# Altium schematic sheet LED Driver.SchDoc
size 297 x 209 mm; CompanyName: Sainsbury Wellcome Centre; Organization: FabLab; Address1: Sainsbury Wellcome Centre; Address2: 25 Howland Street; Address3: London; Address4: W1T 4JG; DocumentNumber: 3; SheetNumber: 3; SheetTotal: 3; swcgroup: FabLab; Org: Sainsbury Wellcome Centre; Add1: 25 Howland Street; Add2: London; Add3: W1T 4JG; WebAddress: www.sainsburywellcome.org; SheetSize: A4; SheetName: LED Driver
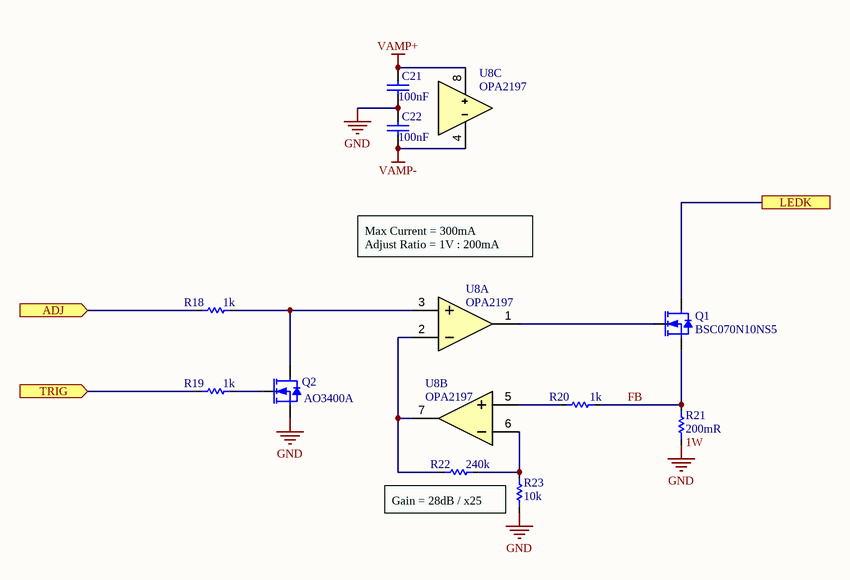
[diagram p0: LED Driver.SchDoc]

## Parts
C21  value 100nF  [CAP_CHIP_0603]  (hidden comment: C0603-100nF-50V)
C22  value 100nF  [CAP_CHIP_0603]  (hidden comment: C0603-100nF-50V)
Q1  BSC070N10NS5  [TDSON-8]
Q2  AO3400A  [SOT23]
R18  value 1k  [RES_CHIP_0603]  (hidden comment: R0603-1K)
R19  value 1k  [RES_CHIP_0603]  (hidden comment: R0603-1K)
R20  value 1k  [RES_CHIP_0603]  (hidden comment: R0603-1K)
R21  value 200mR  Power Rating: 1W  [RES_CHIP_2010]  (hidden comment: R2010-0R2)
R22  value 240k  [RES_CHIP_0603]  (hidden comment: R0603-240K)
R23  value 10k  [RES_CHIP_0603]  (hidden comment: R0603-10K)
U8  OPA2197  [SOIC8]  (parts A,B,C of 3)

## Ports
ADJ (in), LEDK, TRIG (in)

## Nets
GND: C21.1 C22.2 Q2.2(S) R21.1 R23.1
VAMP+: C21.2 U8.8(V+)
VAMP-: C22.1 U8.4(V-)
ADJ: R18.2 ; port ADJ
FB: Q1.1,2,3(S) R20.2 R21.2
LEDK: Q1.5(D) ; port LEDK
TRIG: R19.2 ; port TRIG
NetQ1_4: Q1.4(G) U8.1(AOUT)
NetQ2_1: Q2.1(G) R19.1
NetQ2_3: Q2.3(D) R18.1 U8.3(A+)
NetR20_1: R20.1 U8.5(B+)
NetR22_1: R22.1 R23.2 U8.6(B-)
NetR22_2: R22.2 U8.2(A-) U8.7(BOUT)

## Notes on the sheet
- Max Current = 300mA
  Adjust Ratio = 1V : 200mA
- Gain = 28dB / x25
- FILE
- VARIANT
- DATE
- REVISION
- SHEET
- /
- PROJECT
- SIZE

## Library data of the parts
C21 C22 = CMP-611-0027-24: 0603 Multilayer Ceramic Capacitors MLCC; PartNumber: CC0603KRX7R9BB104; Tolerance: 10%; Pick&PlaceFootprint: C0603; Dielectric: X7R; Voltage Rating: 50V; Capacitor Type: Ceramic; RoHS: Yes; Mount: SMD; LCSC Part N.: C14663; Case/Package: 0603
Q1 = CMP-830-0011-2: MOSFET Power-Transistor, 100V / Superior thermal resistance; Polarity: N-CHANNEL; Fall Time: 6ns; Gate to Source Voltage (Vgs): 20V; Max Power Dissipation: 83W; Rise Time: 5ns; Drain to Source Resistance: 10.2mR; LCSC Part N.: C534364; Drain to Source Voltage (Vdss): 100V; PartNumber: BSC070N10NS5
Q2 = CMP-810-0002-2: 30V 5.7A 26.5mΩ@10V,5.7A 1.4W 1.5V@250uA 1 NChannel SOT-23-3L MOSFETs; Gate-Source Voltage (Vgs): 12V; Pick&PlaceFootprint: SOT-23; RDS(ON): 26.5mR; Switching Time: 34.5ns; LCSC Part N.: C20917; Drain-Source Voltage (Vds): 30V; Mount: Surface Mount; PartNumber: AO3400A; Power Dissipation: 1.4W; Drain Current (Id): 5.7A; Polarity: N Channel
R18-R20 = CMP-633-0013-26: 100mW Thick Film Resistors 75V ±100ppm/℃ ±1% 0603 Chip Resistor; PartNumber: 0603WAF1001T5E; Pick&PlaceFootprint: R0603; Number of Resistors: 1; Voltage Rating: 75V; Mount: Surface Mount; Case/Package: 0603; LCSC Part N.: C21190; Tolerance: 1%; Power Rating: 100mW
R21 = CMP-633-0149-2: Res Metal Strip 2010 0.2 Ohm 1% 1W ±75ppm/°C Molded SMD SMD Embossed Plastic T/R; PartNumber: WSL2010R2000FEA18; Pick&PlaceFootprint: 2010; Voltage Rating: 200V; Number of Resistors: 1; Tolerance: 1%; LCSC Part N.: C2073579; Case/Package: 2010; Mount: Surface Mount
R22 = CMP-633-0073-25: 100mW Thick Film Resistors 75V ±100ppm/℃ ±1% 0603 Chip Resistor; PartNumber: AC0603DR-07240KL; Pick&PlaceFootprint: R0603; Number of Resistors: 1; Voltage Rating: 75V; Tolerance: 1%; Mount: Surface Mount; Case/Package: 0603; Power Rating: 100mW; LCSC Part N.: C227471
R23 = CMP-633-0002-26: 100mW Thick Film Resistors 75V ±100ppm/℃ ±1% 0603 Chip Resistor; PartNumber: 0603WAF1002T5E; Number of Resistors: 1; Pick&PlaceFootprint: R0603; Case/Package: 0603; Voltage Rating: 75V; Power Rating: 100mW; LCSC Part N.: C25804; Tolerance: 1%; Mount: Surface Mount
U8 = CMP-941-0015-1: 10MHz 5pA Dual channel SOIC-8 Precision Op Amps; PartNumber: OPA2197IDR; Min Supply Voltage: 4.5V; Input Offset Voltage: 250uV; CMRR: 120dB; Slew Rate: 20V/µs; Number of Channels: 2; Voltage Drift: 0.5µV/°C; Max Supply Voltage: 36V; Quiescent Current: 1mA; Max Supply Current: 65mA; LCSC Part N.: C139363; Bandwidth: 10MHz; Input Bias Current: 5pA; PSRR: 120dB